# Altium project Quad-Stage-Prototype.PrjPcb
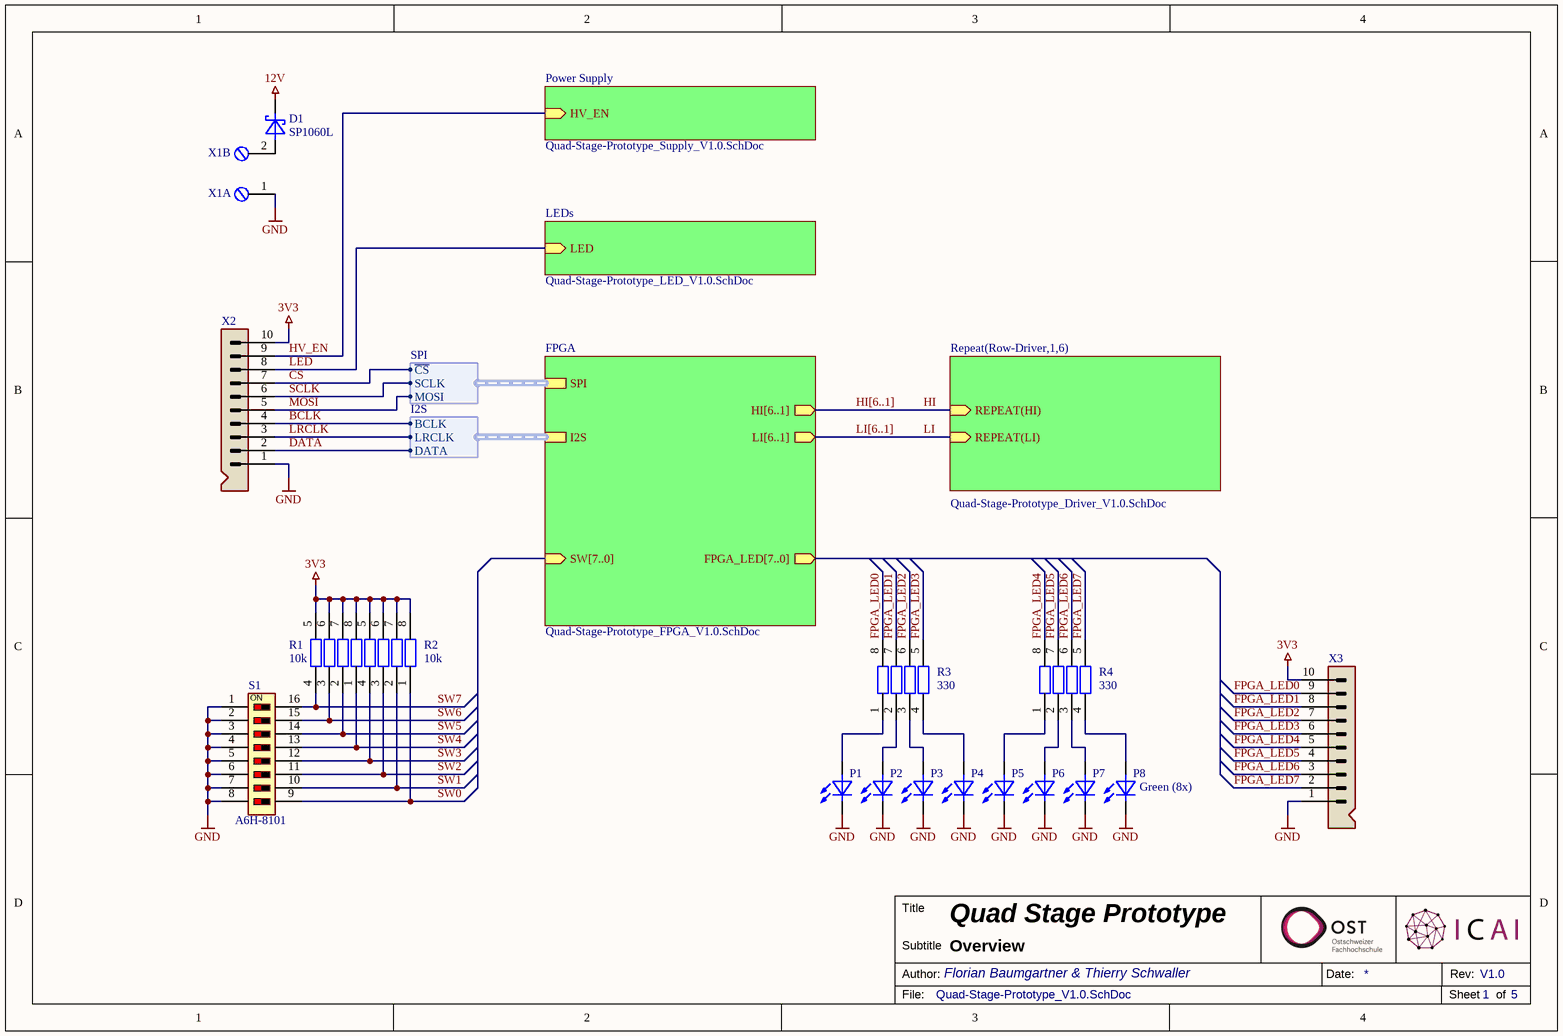
[diagram p0: Quad-Stage-Prototype_V1.0.SchDoc]
5 sheets, 273 parts. Net scope: hierarchical (ports join the sheet entries above them; power ports are global).
Board file: Quad-Stage-Prototype_V1.0.PcbDoc
Sheets:
  Quad-Stage-Prototype_V1.0.SchDoc
    Row-Driver1 = Quad-Stage-Prototype_Driver_V1.0.SchDoc
    Row-Driver2 = Quad-Stage-Prototype_Driver_V1.0.SchDoc
    Row-Driver3 = Quad-Stage-Prototype_Driver_V1.0.SchDoc
    Row-Driver4 = Quad-Stage-Prototype_Driver_V1.0.SchDoc
    Row-Driver5 = Quad-Stage-Prototype_Driver_V1.0.SchDoc
    Row-Driver6 = Quad-Stage-Prototype_Driver_V1.0.SchDoc
    Power Supply = Quad-Stage-Prototype_Supply_V1.0.SchDoc
    FPGA = Quad-Stage-Prototype_FPGA_V1.0.SchDoc
    LEDs = Quad-Stage-Prototype_LED_V1.0.SchDoc

## Sheet Quad-Stage-Prototype_V1.0.SchDoc: Quad Stage Prototype
size A4; PageSetup: Record=PageOptions|CenterHorizontal=True|CenterVertical=True|PrintScale=0.97|XCorrection=1.00|YCorrection=1.00|PrintKind=0|BorderSize=5000000|LeftOffset=0|BottomOffset=0|Orientation=2|PaperLength=1000|PaperWidth=1000|Scale=100|PaperSource=7|PrintQuality=-3|MediaType=1|DitherType=10|PrintScaleMode=1|PaperKind=A4|PaperIndex=9; Organization: Ostschweizer Fachhochschule; Address2: Florian Baumgartner & Thierry Schwaller; Address3: florian.baumgartner@ost.ch; DocumentNumber: 1; Revision: V1.0; SheetNumber: 1; SheetTotal: 5; Author: Florian Baumgartner & Thierry Schwaller; Subtitle: Overview

### Parts
D1  SP1060L  [SMD Diode TO-277]
P1  Green  [SMD LED 0603]  (value not drawn)
P2  Green  [SMD LED 0603]  (value not drawn)
P3  Green  [SMD LED 0603]  (value not drawn)
P4  Green  [SMD LED 0603]  (value not drawn)
P5  Green  [SMD LED 0603]  (value not drawn)
P6  Green  [SMD LED 0603]  (value not drawn)
P7  Green  [SMD LED 0603]  (value not drawn)
P8  Green  [SMD LED 0603]  (value not drawn)
R1  10k  [SMD Widerstand Array 4-Fach 0603]
R2  10k  [SMD Widerstand Array 4-Fach 0603]
R3  330  [SMD Widerstand Array 4-Fach 0603]
R4  330  [SMD Widerstand Array 4-Fach 0603]
S1  A6H-8101  [SMD DIP-Switch 8-Pos]
X1  X-Klemme (2-Pol)  [THT Schraubklemme 2-Pol (WJ500V-5.08-2P)]  (value not drawn)  (parts A,B of 2)
X2  Stiftleiste (10-Fach)  [THT Pin-Header 10x1 (90°)]  (value not drawn)
X3  Stiftleiste (10-Fach)  [THT Pin-Header 10x1 (90°)]  (value not drawn)

### Sub-sheets
FPGA = Quad-Stage-Prototype_FPGA_V1.0.SchDoc: LI[6..1] (out), HI[6..1] (out), I2S (harness I2S), SPI (harness SPI), FPGA_LED[7..0] (out), SW[7..0] (in)
LEDs = Quad-Stage-Prototype_LED_V1.0.SchDoc: LED (in)
Power Supply = Quad-Stage-Prototype_Supply_V1.0.SchDoc: HV_EN (in)
Repeat(Row-Driver,1,6) = Quad-Stage-Prototype_Driver_V1.0.SchDoc: REPEAT(HI) (in), REPEAT(LI) (in)

### Harnesses
SPI: SCLK, MOSI, ~{CS}
I2S: BCLK, LRCLK, DATA

### Nets
3V3: R1.5 R1.6 R1.7 R1.8 R2.5 R2.6 R2.7 R2.8 X2.10 X3.10
12V: D1.K
GND: P1.K P2.K P3.K P4.K P5.K P6.K P7.K P8.K S1.1 S1.2 S1.3 S1.4 S1.5 S1.6 S1.7 S1.8 X1.1 X2.1 X3.1
BCLK: X2.4 ; sheet FPGA/I2S.BCLK
~{CS}: X2.7 ; sheet FPGA/SPI.~{CS}
DATA: X2.2 ; sheet FPGA/I2S.DATA
FPGA_LED0: R3.8 X3.9
FPGA_LED1: R3.7 X3.8
FPGA_LED2: R3.6 X3.7
FPGA_LED3: R3.5 X3.6
FPGA_LED4: R4.8 X3.5
FPGA_LED5: R4.7 X3.4
FPGA_LED6: R4.6 X3.3
FPGA_LED7: R4.5 X3.2
HI: sheet Repeat(Row-Driver,1,6)/REPEAT(HI)
HV_EN: X2.9 ; sheet Power Supply/HV_EN
LED: X2.8 ; sheet LEDs/LED
LI: sheet Repeat(Row-Driver,1,6)/REPEAT(LI)
LRCLK: X2.3 ; sheet FPGA/I2S.LRCLK  [project net FPGA_C9]
MOSI: X2.5 ; sheet FPGA/SPI.MOSI  [project net FPGA_C5]
SCLK: X2.6 ; sheet FPGA/SPI.SCLK  [project net FPGA_C3]
SW0: R2.1 S1.9
SW1: R2.2 S1.10
SW2: R2.3 S1.11
SW3: R2.4 S1.12
SW4: R1.1 S1.13
SW5: R1.2 S1.14
SW6: R1.3 S1.15
SW7: R1.4 S1.16
NetD1_A: D1.A X1.2
NetP1_A: P1.A R3.1
NetP2_A: P2.A R3.2
NetP3_A: P3.A R3.3
NetP4_A: P4.A R3.4
NetP5_A: P5.A R4.1
NetP6_A: P6.A R4.2
NetP7_A: P7.A R4.3
NetP8_A: P8.A R4.4

### Buses and harness runs
bus HI[6..1] = sheet FPGA/HI[6..1]
bus LI[6..1] = sheet FPGA/LI[6..1]

### Notes on the sheet
- (near P8) Green (8x)
- Title
- Author:
- Subtitle
- Date:
- Rev:
- File:
- Sheet
- of
- (in symbol S-A6H-8101) ON

### Library data of the parts
D1 = R-DIODE:SCHKY: S-DIODE; Component Description: Low Voltage Schottky-Diode; JLC-Parts: C2693399; ComponentLink1Description: Datasheet; ComponentLink1URL: https://datasheet.lcsc.com/lcsc/2103051837_Changjiang-Electronics-Tech--CJ-SP1060L_C2693399.pdf; Component Value: SP1060L; Unit Price: 0.32
P1-P8 = LED Green 0603: General Purpose LED; Component Value: Green (5mA, 2.4V); Digikey: 350-2035-1-ND; Farnell: 1465991; Mouser: 645-598-8070-107F; Unit Price: 0.34; ComponentLink1Description: Datasheet; ComponentLink1URL: https://datasheet.lcsc.com/szlcsc/Everlight-Elec-19-217-GHC-YR1S2-3T_C72043.pdf; JLC-Parts: C72043; Component Description: General Purpose LED
R1 R2 = R-Array Single Quad E24 - 10k: Isolated Resistor Array; Component Value: 10k (4x, 50V, 62.5mW, 5%); ComponentLink1Description: Datasheet; ComponentLink1URL: https://datasheet.lcsc.com/lcsc/1810191515_UNI-ROYAL-Uniroyal-Elec-4D03WGJ0103T5E_C29718.pdf; Digikey: Y4103CT-ND; Farnell: 2060167; JLC-Parts: C29718; Mouser: 667-EXB-V8V103JV; Unit Price: 0.01; Component Description: Isolated Resistor Array
R3 R4 = R-Array Single Quad E24 - 330: Isolated Resistor Array; Component Value: 330 (4x, 50V, 62.5mW, 5%); ComponentLink1Description: Datasheet; ComponentLink1URL: https://datasheet.lcsc.com/lcsc/1810170717_UNI-ROYAL-Uniroyal-Elec-4D03WGJ0331T5E_C12018.pdf; Digikey: Y4331CT-ND; Farnell: 2060160; JLC-Parts: C12018; Mouser: 667-EXB-V8V331JV; Unit Price: 0.01; Component Description: Isolated Resistor Array
S1 = S-A6H-8101: DIP-Switch 8 Positions; Digikey: SW1118-ND; Farnell: 8774277; Mouser: 653-A6H-8101; JLC-Parts: C89711; Component Description: DIP-Switch 8 Positions; Component Value: A6H-8101; Unit Price: 2.92
X1 = X-Klemme (2-Pol): Component Description: Screw Terminal; Component Value: WJ500V-5.08-2P (2-Pol, 250V, 8A, 5.08mm); ComponentLink1Description: Datasheet; ComponentLink1URL: https://datasheet.lcsc.com/lcsc/1912251636_Ningbo-Kangnex-Elec-WJ500V-5-08-2P_C8465.pdf; JLC-Parts: C8465; Unit Price: 0.08
X2 X3 = X-Stiftleiste (10-Fach): Component Description: Pin Header; Component Value: 10-Pol; Digikey: 952-2250-ND; Farnell: 3756366; Mouser: 855-M20-9961045; Unit Price: 0.55

## Sheet Quad-Stage-Prototype_Driver_V1.0.SchDoc: Quad Stage Prototype
size A4; PageSetup: Record=PageOptions|CenterHorizontal=True|CenterVertical=True|PrintScale=0.97|XCorrection=1.00|YCorrection=1.00|PrintKind=0|BorderSize=5000000|LeftOffset=0|BottomOffset=0|Orientation=2|PaperLength=1000|PaperWidth=1000|Scale=100|PaperSource=7|PrintQuality=-3|MediaType=1|DitherType=10|PrintScaleMode=1|PaperKind=A4|PaperIndex=9; Organization: Ostschweizer Fachhochschule; Address2: Florian Baumgartner & Thierry Schwaller; Address3: florian.baumgartner@ost.ch; DocumentNumber: 4; Revision: V1.0; SheetNumber: 4; SheetTotal: 5; Author: Florian Baumgartner & Thierry Schwaller; Subtitle: H-Bridge Driver
Used 6 times, as channels Row-Driver1, Row-Driver2, Row-Driver3, Row-Driver4, Row-Driver5, Row-Driver6. Parts and nets are listed once, with the designators drawn on the sheet.
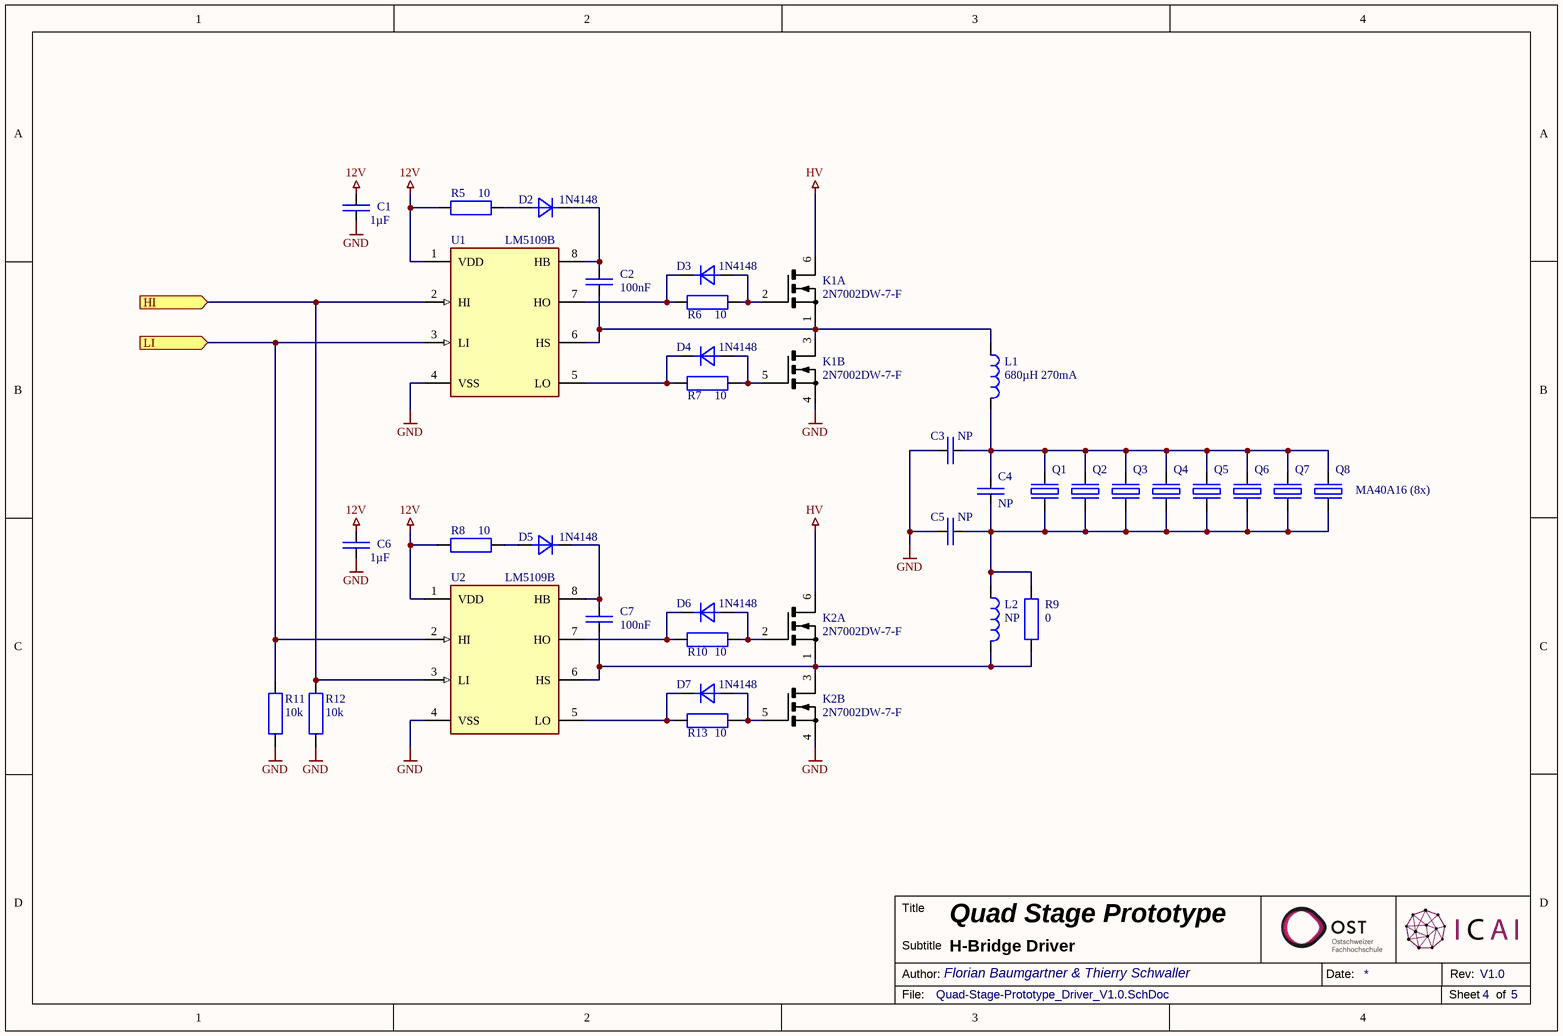
[diagram p1: Quad-Stage-Prototype_Driver_V1.0.SchDoc]

### Parts
C1  1µF  [SMD Keramikkondensator 0603]
C2  100nF  [SMD Keramikkondensator 0603]
C3  NP  [SMD Keramikkondensator 0603]
C4  NP  [SMD Keramikkondensator 0603]
C5  NP  [SMD Keramikkondensator 0603]
C6  1µF  [SMD Keramikkondensator 0603]
C7  100nF  [SMD Keramikkondensator 0603]
D2  1N4148  [SMD Diode SOD-123]
D3  1N4148  [SMD Diode SOD-123]
D4  1N4148  [SMD Diode SOD-123]
D5  1N4148  [SMD Diode SOD-123]
D6  1N4148  [SMD Diode SOD-123]
D7  1N4148  [SMD Diode SOD-123]
K1  2N7002DW-7-F  [SMD IC SOT-363 (SC-70-6)]  (parts A,B of 2)
K2  2N7002DW-7-F  [SMD IC SOT-363 (SC-70-6)]  (parts A,B of 2)
L1  680µH 270mA  [SMD Inductor 7x7x4.5]
L2  NP  [SMD Inductor 7x7x4.5 NP]
Q1  MA40A16  [THT Transducer (MA40A16)]  (value not drawn)
Q2  MA40A16  [THT Transducer (MA40A16)]  (value not drawn)
Q3  MA40A16  [THT Transducer (MA40A16)]  (value not drawn)
Q4  MA40A16  [THT Transducer (MA40A16)]  (value not drawn)
Q5  MA40A16  [THT Transducer (MA40A16)]  (value not drawn)
Q6  MA40A16  [THT Transducer (MA40A16)]  (value not drawn)
Q7  MA40A16  [THT Transducer (MA40A16)]  (value not drawn)
Q8  MA40A16  [THT Transducer (MA40A16)]  (value not drawn)
R5  10  [SMD Widerstand 0603]
R6  10  [SMD Widerstand 0603]
R7  10  [SMD Widerstand 0603]
R8  10  [SMD Widerstand 0603]
R9  0  [SMD Widerstand 0603]
R10  10  [SMD Widerstand 0603]
R11  10k  [SMD Widerstand 0603]
R12  10k  [SMD Widerstand 0603]
R13  10  [SMD Widerstand 0603]
U1  LM5109B  [SMD IC SOIC-8]
U2  LM5109B  [SMD IC SOIC-8]

### Ports
HI (in), LI (in)

### Nets
12V: C1.2 C6.2 R5.2 R8.2 U1.1(VDD) U2.1(VDD)
GND: C1.1 C3.2 C5.2 C6.1 K1.4(S2) K2.4(S2) R11.1 R12.1 U1.4(VSS) U2.4(VSS)
HV: K1.6(D1) K2.6(D1)
HI: R12.2 U1.2(HI) U2.3(LI) ; port HI
LI: R11.2 U1.3(LI) U2.2(HI) ; port LI
NetC2_1: C2.1 K1.1(S1) K1.3(D2) L1.1 U1.6(HS)
NetC2_2: C2.2 D2.K U1.8(HB)
NetC3_1: C3.1 C4.2 L1.2 Q1.2 Q2.2 Q3.2 Q4.2 Q5.2 Q6.2 Q7.2 Q8.2
NetC4_1: C4.1 C5.1 L2.2 Q1.1 Q2.1 Q3.1 Q4.1 Q5.1 Q6.1 Q7.1 Q8.1 R9.2
NetC7_1: C7.1 K2.1(S1) K2.3(D2) L2.1 R9.1 U2.6(HS)
NetC7_2: C7.2 D5.K U2.8(HB)
NetD2_A: D2.A R5.1
NetD3_A: D3.A K1.2(G1) R6.1
NetD3_K: D3.K R6.2 U1.7(HO)
NetD4_A: D4.A K1.5(G2) R7.1
NetD4_K: D4.K R7.2 U1.5(LO)
NetD5_A: D5.A R8.1
NetD6_A: D6.A K2.2(G1) R10.1
NetD6_K: D6.K R10.2 U2.7(HO)
NetD7_A: D7.A K2.5(G2) R13.1
NetD7_K: D7.K R13.2 U2.5(LO)

### Channels
Row-Driver1: designators end in _1; ports HI=FPGA_B48 LI=FPGA_B49
Row-Driver2: designators end in _2; ports HI=FPGA_B45 LI=FPGA_B46
Row-Driver3: designators end in _3; ports HI=FPGA_B42 LI=FPGA_B43
Row-Driver4: designators end in _4; ports HI=FPGA_B39 LI=FPGA_B40
Row-Driver5: designators end in _5; ports HI=FPGA_B36 LI=FPGA_B37
Row-Driver6: designators end in _6; ports HI=FPGA_B33 LI=FPGA_B34

### Notes on the sheet
- (near Q8) MA40A16 (8x)
- Title
- Author:
- Subtitle
- Date:
- Rev:
- File:
- Sheet
- of

### Library data of the parts
C1 C6 = C-CAPACITOR: CAP-MK; Component Description: Multilayer Ceramic Capacitors; Component Value: 1µF 50V; Digikey: 1276-1860-1-ND; Farnell: 3013383; Mouser: 187-CL10A105KB8NNNC; JLC-Parts: C15849; Unit Price: 0.01
C2 C7 = C-CAPACITOR: CAP-MK; Component Description: Multilayer Ceramic Capacitors; Component Value: 100nF 50V; Digikey: 445-5666-1-ND; Farnell: 2522432; Mouser: 77-VJ0603V104ZXAPBC; JLC-Parts: C14663; Unit Price: 0.01
C3-C5 = C-CAPACITOR: CAP-MK; Component Description: Multilayer Ceramic Capacitors; Component Value: NP
D2-D7 = R-DIODE: DIODE (alt V); Component Description: Fast Switching Diode; Component Value: 1N4148WTR; Digikey: 1655-1360-1-ND; Farnell: 2306363; Mouser: 750-1N4148W-HF; ComponentLink1Description: Datasheet; ComponentLink1URL: https://datasheet.lcsc.com/lcsc/1811061725_ST-Semtech-1N4148W_C81598.pdf; JLC-Parts: C81598; Unit Price: 0.01
K1 K2 = K-2N7002DW-7-F: Dual N-Channel MOSFET; Digikey: 2N7002DW-FDICT-ND; Mouser: 621-2N7002DW-F; ComponentLink1Description: Datasheet; ComponentLink1URL: https://datasheet.lcsc.com/lcsc/1810111020_Diodes-Incorporated-2N7002DW-7-F_C83571.pdf; JLC-Parts: C83571; Component Description: Dual N-Channel MOSFET; Component Value: 2N7002DW-7-F; Unit Price: 0.35
L1 = L-COIL: Shielded Power Inductor; Component Value: SLF7045T-681MR20-PF (680µH 270mA); ComponentLink1Description: Datasheet; ComponentLink1URL: https://datasheet.lcsc.com/lcsc/1806061130_TDK-SLF7045T-681MR20-PF_C91522.pdf; Digikey: 445-2028-1-ND; Farnell: 2215732; JLC-Parts: C91522; Mouser: 810-SLF7045T-681M; Component Description: Shielded Power Inductor; Unit Price: 0.32
L2 = L-COIL: Shielded Power Inductor; ComponentLink1Description: Datasheet; Component Description: Shielded Power Inductor
Q1-Q8 = Q-Piezo: Ultrasonic Transducer; Component Value: MA40A16 (40kHz, 16mm); ComponentLink1Description: Datasheet; Component Description: Ultrasonic Transducer; Unit Price: 0.40
  Q2-Q8: JLC-Parts: C115962
R5-R8 R10 R13 = R-RESISTOR: RES (E=Heizwiderstand B=Messwandler); Component Description: Thick Film Chip Resistor; Component Value: 10 (75V, 100mW, 1%); Digikey: P10.0HCT-ND; Farnell: 2302958; Mouser: 667-ERJ-3EKF10R0V; JLC-Parts: C22859; Unit Price: 0.01
R9 = R-RESISTOR: RES (E=Heizwiderstand B=Messwandler); Component Description: Thick Film Chip Resistor; Component Value: 0 (75V, 100mW, 1%); Digikey: 311-0.0GRCT-ND; Farnell: 9233130; Mouser: 603-RC0603JR-070RL; JLC-Parts: C21189; Unit Price: 0.01
R11 R12 = R-RESISTOR: RES (E=Heizwiderstand B=Messwandler); Component Description: Thick Film Chip Resistor; Component Value: 10k (75V, 100mW, 1%); Digikey: P10.0KHCT-ND; Farnell: 2303192; Mouser: 667-ERJ-3EKF1002V; JLC-Parts: C25804; Unit Price: 0.01
U1 U2 = U-LM5109B: High Voltage 1A Peak Half Bridge Gate Driver; Component Description: High Voltage Gate Driver; ComponentLink1Description: Datasheet; ComponentLink1URL: https://datasheet.lcsc.com/lcsc/1809172040_Texas-Instruments-LM5109AMAX-NOPB_C129332.pdf; Digikey: LM5109BMA/NOPB-ND; Component Value: LM5109B; Farnell: 3005776; JLC-Parts: C116862; Mouser: 926-LM5109BMAX/NOPB; Unit Price: 1.13

## Sheet Quad-Stage-Prototype_Supply_V1.0.SchDoc: Quad Stage Prototype
size A4; PageSetup: Record=PageOptions|CenterHorizontal=True|CenterVertical=True|PrintScale=0.97|XCorrection=1.00|YCorrection=1.00|PrintKind=0|BorderSize=5000000|LeftOffset=0|BottomOffset=0|Orientation=2|PaperLength=1000|PaperWidth=1000|Scale=100|PaperSource=7|PrintQuality=-3|MediaType=1|DitherType=10|PrintScaleMode=1|PaperKind=A4|PaperIndex=9; Organization: Ostschweizer Fachhochschule; Address2: Florian Baumgartner & Thierry Schwaller; Address3: florian.baumgartner@ost.ch; DocumentNumber: 2; Revision: V1.0; SheetNumber: 2; SheetTotal: 5; Author: Florian Baumgartner & Thierry Schwaller; Subtitle: Power Supply
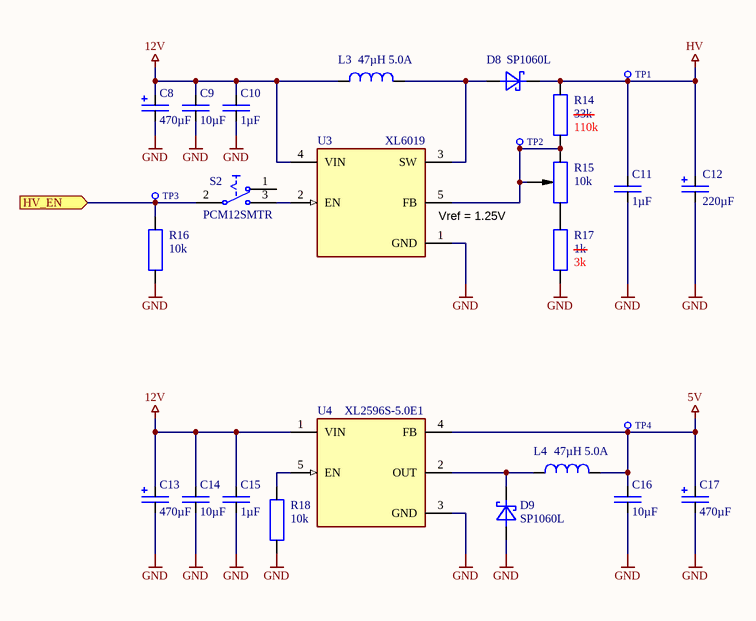
[diagram p2: Quad-Stage-Prototype_Supply_V1.0.SchDoc]

### Parts
C8  470µF  [SMD Elko 10.0x10.0]
C9  10µF  [SMD Keramikkondensator 1206]
C10  1µF  [SMD Keramikkondensator 0603]
C11  1µF  [SMD Keramikkondensator 1206]
C12  220µF  [SMD Elko 12.5x13.5]
C13  470µF  [SMD Elko 10.0x10.0]
C14  10µF  [SMD Keramikkondensator 1206]
C15  1µF  [SMD Keramikkondensator 0603]
C16  10µF  [SMD Keramikkondensator 1206]
C17  470µF  [SMD Elko 10.0x10.0]
D8  SP1060L  [SMD Diode TO-277]
D9  SP1060L  [SMD Diode TO-277]
L3  47µH 5.0A  [SMD Inductor 13.8x12.6x6.5]
L4  47µH 5.0A  [SMD Inductor 13.8x12.6x6.5]
R14  33k  [SMD Widerstand 0603]
R15  10k  [THT Potentiometer (RK09D1130C2P)]
R16  10k  [SMD Widerstand 0603]
R17  1k  [SMD Widerstand 0603]
R18  10k  [SMD Widerstand 0603]
S2  PCM12SMTR  [SMD Switch SPDT (PCM12SMTR)]
TP1  X-TP  [THT Testpunkt Ø1mm]  (value not drawn)  (no BOM)
TP2  X-TP  [THT Testpunkt Ø1mm]  (value not drawn)  (no BOM)
TP3  X-TP  [THT Testpunkt Ø1mm]  (value not drawn)  (no BOM)
TP4  X-TP  [THT Testpunkt Ø1mm]  (value not drawn)  (no BOM)
U3  XL6019  [SMD IC TO-263-5]
U4  XL2596S-5.0E1  [SMD IC TO-263-5]

### Ports
HV_EN (in)

### Nets
5V: C16.2 C17.P(+) L4.1 TP4.1 U4.4(FB)
12V: C8.P(+) C9.2 C10.2 C13.P(+) C14.2 C15.2 L3.1 U3.4(VIN) U4.1(VIN)
GND: C8.M(-) C9.1 C10.1 C11.1 C12.M(-) C13.M(-) C14.1 C15.1 C16.1 C17.M(-) D9.A R16.1 R17.1 R18.1 U3.1(GND) U4.3(GND)
HV: C11.2 C12.P(+) D8.K R14.2 TP1.1
HV_EN: R16.2 S2.2(COMMON1) TP3.1 ; port HV_EN
NetD8_A: D8.A L3.2 U3.3(SW)
NetD9_K: D9.K L4.2 U4.2(OUT)
NetR14_1: R14.1 R15.CW R15.M TP2.1 U3.5(FB)
NetR15_CCW: R15.CCW R17.2
NetR18_2: R18.2 U4.5(EN)
NetS2_3: S2.3(NO1) U3.2(EN)

Not connected (* = marked no-connect by the designer): S2 1(NC1)

### Notes on the sheet
- (near R14) 110k
- (near U3) Vref = 1.25V
- (near R17) 3k
- Title
- Author:
- Subtitle
- Date:
- Rev:
- File:
- Sheet
- of

### Library data of the parts
C8 C13 C17 = C-ELCAP: CAP-Elko; Component Description: Electrolytic Capacitor; Component Value: 470µF 25V; Mouser: 140-VEJ471M1ETR1010; JLC-Parts: C176672; Unit Price: 0.17
C9 C14 C16 = C-CAPACITOR: CAP-MK; Component Description: Multilayer Ceramic Capacitors; Component Value: 10µF 50V; Digikey: 445-7886-1-ND; Farnell: 2211092; Mouser: 810-CGA5L3X5R1H106K; JLC-Parts: C13585; Unit Price: 0.27
C10 C15 = C-CAPACITOR: as C1 on sheet Quad-Stage-Prototype_Driver_V1.0; Digikey: 1276-1860-1-ND; Farnell: 3013383; Mouser: 187-CL10A105KB8NNNC; JLC-Parts: C15849; Unit Price: 0.01
C11 = C-CAPACITOR: CAP-MK; Component Description: Multilayer Ceramic Capacitors; Component Value: 1µF 100V; Digikey: 720-VJ1206Y104MXBATCT-ND; Farnell: 1657939; Mouser: 77-VJ1206Y104MXBAT; JLC-Parts: C91151; Unit Price: 0.01
C12 = C-ELCAP: CAP-Elko; Component Description: Electrolytic Capacitor; Component Value: 220µF 63V; JLC-Parts: C249502; Unit Price: 0.42
D8 D9 = R-DIODE:SCHKY: as D1 on sheet Quad-Stage-Prototype_V1.0; JLC-Parts: C2693399; ComponentLink1Description: Datasheet; ComponentLink1URL: https://datasheet.lcsc.com/lcsc/2103051837_Changjiang-Electronics-Tech--CJ-SP1060L_C2693399.pdf; Component Value: SP1060L; Unit Price: 0.32
L3 L4 = L-COIL: Shielded Power Inductor; ComponentLink1Description: Datasheet; ComponentLink1URL: https://datasheet.lcsc.com/lcsc/2003172239_YJYCOIN-YSPI1365-470M_C497913.pdf; Digikey: 118-SRP1265WA-470MCT-ND; Farnell: 3929029; JLC-Parts: C497913; Mouser: 652-SRP1265WA-470M; Component Description: Shielded Power Inductor; Component Value: 47µH 5.0A; Unit Price: 0.68
R14 = R-RESISTOR: RES (E=Heizwiderstand B=Messwandler); Component Description: Thick Film Chip Resistor; Component Value: 33k (75V, 100mW, 1%); Digikey: P33.0KHCT-ND; Farnell: 2303204; Mouser: 667-ERJ-3EKF3302V; JLC-Parts: C4216; Unit Price: 0.01
R15 = R-RES:VAR: RES-VAR; Component Description: Potentiometer; Component Value: RK09D1130C2P (10k); ComponentLink1Description: Datasheet; ComponentLink1URL: https://tech.alpsalpine.com/prod/e/html/potentiometer/rotarypotentiometers/rk09k/rk09d1130c2p.html; JLC-Parts: C361173; Mouser: 688-RK09D1130C2P; Unit Price: 0.90
R16 R18 = R-RESISTOR: as R11 on sheet Quad-Stage-Prototype_Driver_V1.0; Digikey: P10.0KHCT-ND; Farnell: 2303192; Mouser: 667-ERJ-3EKF1002V; JLC-Parts: C25804; Unit Price: 0.01
R17 = R-RESISTOR: RES (E=Heizwiderstand B=Messwandler); Component Description: Thick Film Chip Resistor; Component Value: 1k (75V, 100mW, 1%); Digikey: P1.00KHCT-ND; Farnell: 2397690; Mouser: 667-ERJ-3EKF1001V; JLC-Parts: C21190; Unit Price: 0.01
S2 = S-PCM12SMTR: Miniature Slide Switch; aliExpress: 33002042977; Component Value: PCM12SMTR (SPDT); Digikey: 401-2016-1-ND; Mouser: 611-PCM12SMTR; Farnell: 9575146; JLC-Parts: C221841; Component Description: Miniature Slide Switch; Unit Price: 0.77
TP1-TP4 = X-TP: Testpunkt; Component Description: Testpoint; Component Value: Ø 0.8mm; Unit Price: 0.00
U3 = U-XL6019: High Power Switching Boost Converter; ComponentLink1Description: Datasheet; ComponentLink1URL: http://www.xlsemi.com/datasheet/XL6019%20datasheet-English.pdf; Component Value: XL6019; JLC-Parts: C73018; Unit Price: 1.00; Component Description: High Power Switching Boost Converter
U4 = U-XL2596S-5.0E1: High Power Switching Buck Converter; ComponentLink1Description: Datasheet; ComponentLink1URL: https://datasheet.lcsc.com/lcsc/1811021340_XLSEMI-XL2596S-5-0E1_C74190.pdf; Component Value: XL2596S-5.0E1; JLC-Parts: C74190; Unit Price: 0.58; Component Description: High Power Switching Buck Converter

## Sheet Quad-Stage-Prototype_FPGA_V1.0.SchDoc: Quad Stage Prototype
size A4; PageSetup: Record=PageOptions|CenterHorizontal=True|CenterVertical=True|PrintScale=0.97|XCorrection=1.00|YCorrection=1.00|PrintKind=0|BorderSize=5000000|LeftOffset=0|BottomOffset=0|Orientation=2|PaperLength=1000|PaperWidth=1000|Scale=100|PaperSource=7|PrintQuality=-3|MediaType=1|DitherType=10|PrintScaleMode=1|PaperKind=A4|PaperIndex=9; Organization: Ostschweizer Fachhochschule; Address2: Florian Baumgartner & Thierry Schwaller; Address3: florian.baumgartner@ost.ch; DocumentNumber: 3; Revision: V1.0; SheetNumber: 3; SheetTotal: 5; Author: Florian Baumgartner & Thierry Schwaller; Subtitle: FPGA
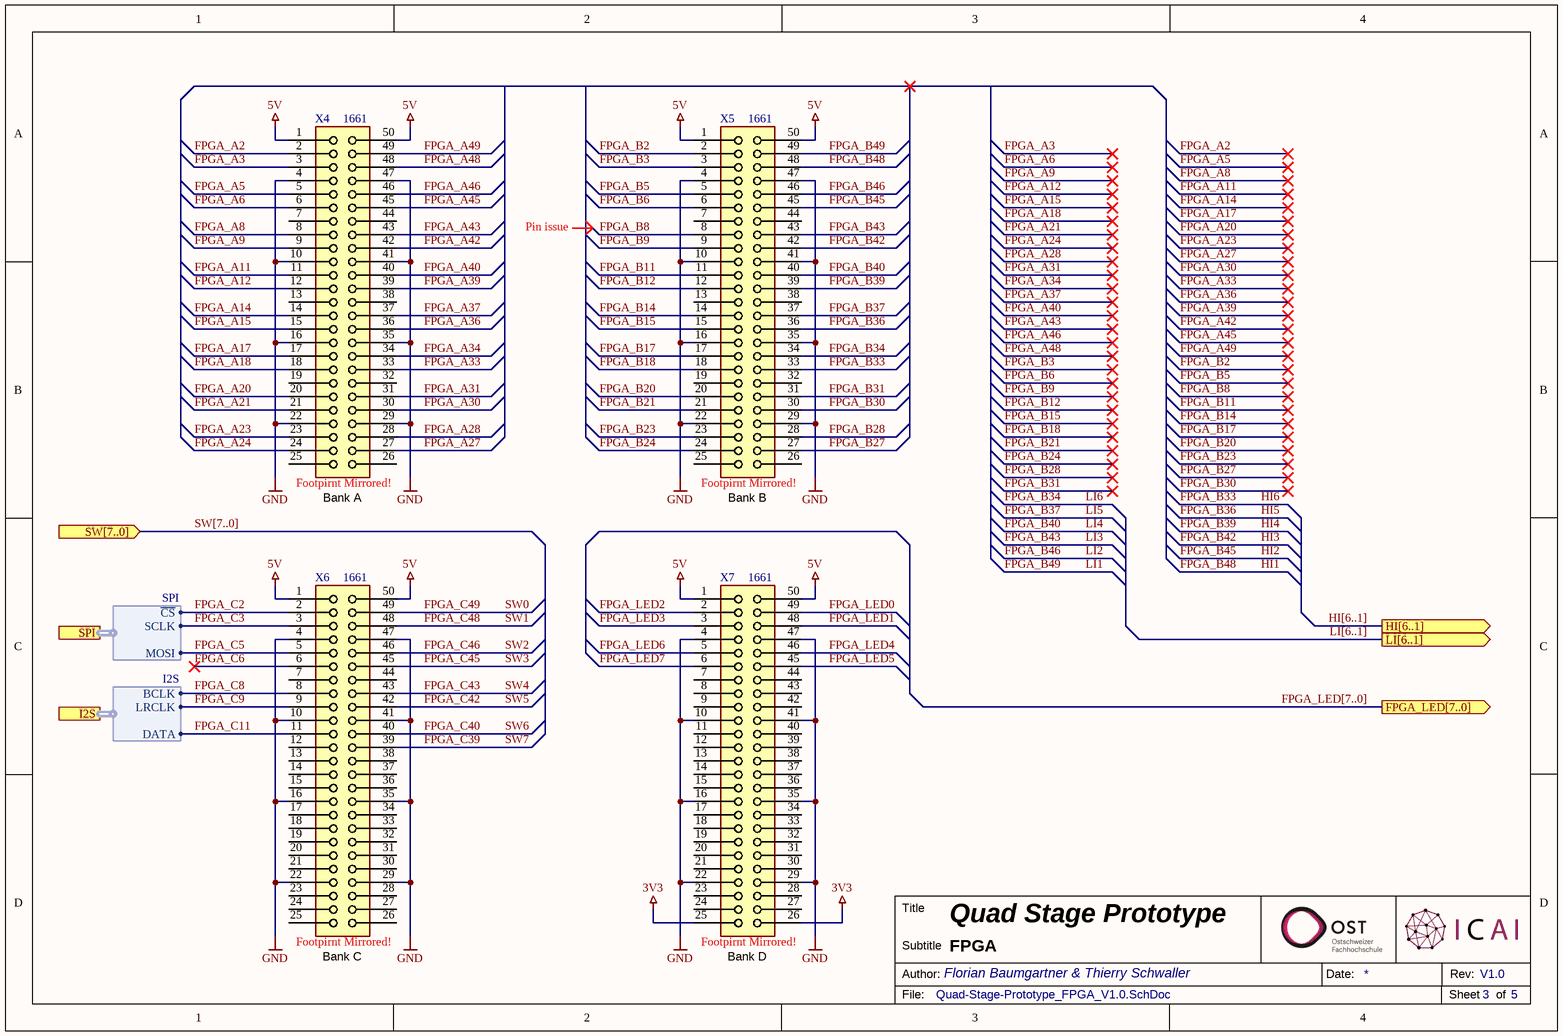
[diagram p3: Quad-Stage-Prototype_FPGA_V1.0.SchDoc]

### Parts
X4  1661  [SMD Connector (1661)]
X5  1661  [SMD Connector (1661)]
X6  1661  [SMD Connector (1661)]
X7  1661  [SMD Connector (1661)]

### Ports
FPGA_LED[7..0] (out), HI[6..1] (out), I2S (harness I2S), LI[6..1] (out), SPI (harness SPI), SW[7..0] (in)

### Harnesses
SPI: SCLK, MOSI, ~{CS}
I2S: BCLK, LRCLK, DATA

### Nets
3V3: X7.25 X7.26
5V: X4.1 X4.50 X5.1 X5.50 X6.1 X6.50 X7.1 X7.50
GND: X4.4 X4.10 X4.16 X4.22 X4.29 X4.35 X4.41 X4.47 X5.4 X5.10 X5.16 X5.22 X5.29 X5.35 X5.41 X5.47 X6.4 X6.10 X6.16 X6.22 X6.29 X6.35 X6.41 X6.47 X7.4 X7.10 X7.16 X7.22 X7.29 X7.35 X7.41 X7.47
FPGA_A2: X4.2
FPGA_A3: X4.3
FPGA_A5: X4.5
FPGA_A6: X4.6
FPGA_A8: X4.8
FPGA_A9: X4.9
FPGA_A11: X4.11
FPGA_A12: X4.12
FPGA_A14: X4.14
FPGA_A15: X4.15
FPGA_A17: X4.17
FPGA_A18: X4.18
FPGA_A20: X4.20
FPGA_A21: X4.21
FPGA_A23: X4.23
FPGA_A24: X4.24
FPGA_A27: X4.27
FPGA_A28: X4.28
FPGA_A30: X4.30
FPGA_A31: X4.31
FPGA_A33: X4.33
FPGA_A34: X4.34
FPGA_A36: X4.36
FPGA_A37: X4.37
FPGA_A39: X4.39
FPGA_A40: X4.40
FPGA_A42: X4.42
FPGA_A43: X4.43
FPGA_A45: X4.45
FPGA_A46: X4.46
FPGA_A48: X4.48
FPGA_A49: X4.49
FPGA_B2: X5.2
FPGA_B3: X5.3
FPGA_B5: X5.5
FPGA_B6: X5.6
FPGA_B8: X5.8
FPGA_B9: X5.9
FPGA_B11: X5.11
FPGA_B12: X5.12
FPGA_B14: X5.14
FPGA_B15: X5.15
FPGA_B17: X5.17
FPGA_B18: X5.18
FPGA_B20: X5.20
FPGA_B21: X5.21
FPGA_B23: X5.23
FPGA_B24: X5.24
FPGA_B27: X5.27
FPGA_B28: X5.28
FPGA_B30: X5.30
FPGA_B31: X5.31
FPGA_B33: X5.33  [also labelled HI6]
FPGA_B34: X5.34  [also labelled LI6]
FPGA_B36: X5.36  [also labelled HI5]
FPGA_B37: X5.37  [also labelled LI5]
FPGA_B39: X5.39  [also labelled HI4]
FPGA_B40: X5.40  [also labelled LI4]
FPGA_B42: X5.42  [also labelled HI3]
FPGA_B43: X5.43  [also labelled LI3]
FPGA_B45: X5.45  [also labelled HI2]
FPGA_B46: X5.46  [also labelled LI2]
FPGA_B48: X5.48  [also labelled HI1]
FPGA_B49: X5.49  [also labelled LI1]
FPGA_C2: X6.2 ; port SPI.~{CS}  [project net ~{CS}]
FPGA_C3: X6.3 ; port SPI.SCLK
FPGA_C5: X6.5 ; port SPI.MOSI
FPGA_C6: X6.6
FPGA_C8: X6.8 ; port I2S.BCLK  [project net BCLK]
FPGA_C9: X6.9 ; port I2S.LRCLK
FPGA_C11: X6.11 ; port I2S.DATA  [project net DATA]
FPGA_C39: X6.39  [also labelled SW7]
FPGA_C40: X6.40  [also labelled SW6]
FPGA_C42: X6.42  [also labelled SW5]
FPGA_C43: X6.43  [also labelled SW4]
FPGA_C45: X6.45  [also labelled SW3]
FPGA_C46: X6.46  [also labelled SW2]
FPGA_C48: X6.48  [also labelled SW1]
FPGA_C49: X6.49  [also labelled SW0]
FPGA_LED0: X7.49
FPGA_LED1: X7.48
FPGA_LED2: X7.2
FPGA_LED3: X7.3
FPGA_LED4: X7.46
FPGA_LED5: X7.45
FPGA_LED6: X7.5
FPGA_LED7: X7.6

Not connected (* = marked no-connect by the designer): X4 7 13 19 25 26 32 38 44; X5 7 13 19 25 26 32 38 44; X6 7 12 13 14 15 17 18 19 20 21 23 24 25 26 27 28 30 31 32 33 34 36 37 38 44; X7 7 8 9 11 12 13 14 15 17 18 19 20 21 23 24 27 28 30 31 32 33 34 36 37 38 39 40 42 43 44

### Buses and harness runs
bus FPGA_LED[7..0] = port FPGA_LED[7..0]
bus HI[6..1] = port HI[6..1]
bus LI[6..1] = port LI[6..1]
bus SW[7..0] = port SW[7..0]

### Notes on the sheet
- Pin issue
- (near X4) Footpirnt Mirrored!
- (near X4) Bank A
- (near X5) Footpirnt Mirrored!
- (near X5) Bank B
- (near X6) Footpirnt Mirrored!
- (near X6) Bank C
- (near X7) Footpirnt Mirrored!
- (near X7) Bank D
- Title
- Author:
- Subtitle
- Date:
- Rev:
- File:
- Sheet
- of

### Library data of the parts
X4-X7 = X-4UCON_1661: Board-to-Board Connector (Receptacle); Component Value: PRT-16890 (1661); Digikey: 1568-PRT-16890-ND; Mouser: 474-PRT-16890; ComponentLink1Description: Datasheet; ComponentLink1URL: http://www.4uconnector.com/online/object/4udrawing/19008.pdf; Component Description: Board-to-Board Connector (Receptacle); Unit Price: 1.60

## Sheet Quad-Stage-Prototype_LED_V1.0.SchDoc: Quad Stage Prototype
size A4; PageSetup: Record=PageOptions|CenterHorizontal=True|CenterVertical=True|PrintScale=0.97|XCorrection=1.00|YCorrection=1.00|PrintKind=0|BorderSize=5000000|LeftOffset=0|BottomOffset=0|Orientation=2|PaperLength=1000|PaperWidth=1000|Scale=100|PaperSource=7|PrintQuality=-3|MediaType=1|DitherType=10|PrintScaleMode=1|PaperKind=A4|PaperIndex=9; Organization: Ostschweizer Fachhochschule; Address2: Florian Baumgartner & Thierry Schwaller; Address3: florian.baumgartner@ost.ch; DocumentNumber: 5; Revision: V1.0; SheetNumber: 5; SheetTotal: 5; Author: Florian Baumgartner & Thierry Schwaller; Subtitle: LEDs
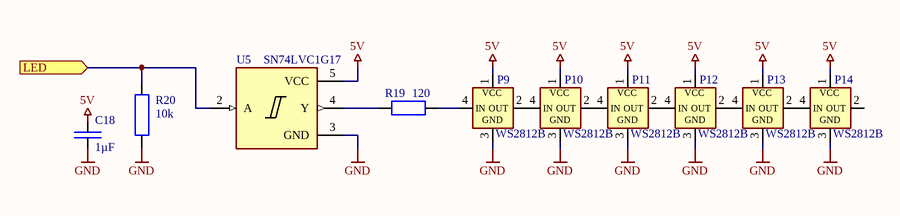
[diagram p4: Quad-Stage-Prototype_LED_V1.0.SchDoc]

### Parts
C18  1µF  [SMD Keramikkondensator 0603]
P9  WS2812B  [SMD LED WS2812B-5050]
P10  WS2812B  [SMD LED WS2812B-5050]
P11  WS2812B  [SMD LED WS2812B-5050]
P12  WS2812B  [SMD LED WS2812B-5050]
P13  WS2812B  [SMD LED WS2812B-5050]
P14  WS2812B  [SMD LED WS2812B-5050]
R19  120  [SMD Widerstand 0603]
R20  10k  [SMD Widerstand 0603]
U5  SN74LVC1G17  [SMD IC SOT-363 (SC-70-5)]

### Ports
LED (in)

### Nets
5V: C18.2 P9.1(VCC) P10.1(VCC) P11.1(VCC) P12.1(VCC) P13.1(VCC) P14.1(VCC) U5.5(VCC)
GND: C18.1 P9.3(GND) P10.3(GND) P11.3(GND) P12.3(GND) P13.3(GND) P14.3(GND) R20.1 U5.3(GND)
LED: R20.2 U5.2(A) ; port LED
NetP9_2: P9.2(OUT) P10.4(IN)
NetP9_4: P9.4(IN) R19.1
NetP10_2: P10.2(OUT) P11.4(IN)
NetP11_2: P11.2(OUT) P12.4(IN)
NetP12_2: P12.2(OUT) P13.4(IN)
NetP13_2: P13.2(OUT) P14.4(IN)
NetR19_2: R19.2 U5.4(Y)

Not connected (* = marked no-connect by the designer): P14 2(OUT); U5 1(NC)

### Notes on the sheet
- Title
- Author:
- Subtitle
- Date:
- Rev:
- File:
- Sheet
- of

### Library data of the parts
C18 = C-CAPACITOR: as C1 on sheet Quad-Stage-Prototype_Driver_V1.0; Digikey: 1276-1860-1-ND; Farnell: 3013383; Mouser: 187-CL10A105KB8NNNC; JLC-Parts: C15849; Unit Price: 0.01
P9-P14 = P-WS2812B: Smart RGB-LED; aliExpress: 32550663121; Digikey: 1568-COM-16346-ND; Mouser: 474-COM-16346; JLC-Parts: C2843785; ComponentLink1Description: Datasheet; ComponentLink1URL: http://cdn.sparkfun.com/datasheets/BreakoutBoards/WS2812B.pdf; Component Description: Smart RGB-LED; Component Value: WS2812B; Unit Price: 0.10
R19 = E24 - 120: SMD Chip Resistor E24; Component Value: 120 (75V, 100mW, 1%); ComponentLink1Description: Datasheet; ComponentLink1URL: https://datasheet.lcsc.com/lcsc/1810200710_UNI-ROYAL-Uniroyal-Elec-0603WAF4701T5E_C23162.pdf; Digikey: P120HCT-ND; Farnell: 2303067; JLC-Parts: C22787; Mouser: 667-ERJ-3EKF1200V; Unit Price: 0.01; Component Description: Chip Resistor
R20 = R-RESISTOR: as R11 on sheet Quad-Stage-Prototype_Driver_V1.0; Digikey: P10.0KHCT-ND; Farnell: 2303192; Mouser: 667-ERJ-3EKF1002V; JLC-Parts: C25804; Unit Price: 0.01
U5 = U-SN74LVC1G17-Q1: Single Schmitt-Trigger Buffer; Digikey: 296-23709-1-ND; Farnell: 2499832; Mouser: 595-74LVC1G17QDCKRQ1; Component Description: Single Schmitt-Trigger Buffer; ComponentLink1Description: Datasheet; ComponentLink1URL: https://datasheet.lcsc.com/lcsc/1809192011_Texas-Instruments-SN74LVC1G17DCKR_C10425.pdf; Component Value: SN74LVC1G17-Q1; JLC-Parts: C10425; Unit Price: 0.36

## Nets that join several sheets
3V3: Quad-Stage-Prototype_V1.0 (10 pins), Quad-Stage-Prototype_FPGA_V1.0 (X7.25 X7.26)
5V: Quad-Stage-Prototype_Supply_V1.0 (5 pins), Quad-Stage-Prototype_FPGA_V1.0 (8 pins), Quad-Stage-Prototype_LED_V1.0 (8 pins)
12V: Quad-Stage-Prototype_V1.0 (D1.K), Row-Driver1 (6 pins), Row-Driver2 (6 pins), Row-Driver3 (6 pins), Row-Driver4 (6 pins), Row-Driver5 (6 pins), Row-Driver6 (6 pins), Quad-Stage-Prototype_Supply_V1.0 (9 pins)
GND: Quad-Stage-Prototype_V1.0 (19 pins), Row-Driver1 (10 pins), Row-Driver2 (10 pins), Row-Driver3 (10 pins), Row-Driver4 (10 pins), Row-Driver5 (10 pins), Row-Driver6 (10 pins), Quad-Stage-Prototype_Supply_V1.0 (16 pins), Quad-Stage-Prototype_FPGA_V1.0 (32 pins), Quad-Stage-Prototype_LED_V1.0 (9 pins)
HV: Row-Driver1 (K1_1.6 K2_1.6), Row-Driver2 (K1_2.6 K2_2.6), Row-Driver3 (K1_3.6 K2_3.6), Row-Driver4 (K1_4.6 K2_4.6), Row-Driver5 (K1_5.6 K2_5.6), Row-Driver6 (K1_6.6 K2_6.6), Quad-Stage-Prototype_Supply_V1.0 (5 pins)
BCLK: Quad-Stage-Prototype_V1.0 (X2.4), Quad-Stage-Prototype_FPGA_V1.0 (X6.8)
~{CS}: Quad-Stage-Prototype_V1.0 (X2.7), Quad-Stage-Prototype_FPGA_V1.0 (X6.2)
DATA: Quad-Stage-Prototype_V1.0 (X2.2), Quad-Stage-Prototype_FPGA_V1.0 (X6.11)
FPGA_B33: Row-Driver6 (R12_6.2 U1_6.2 U2_6.3), Quad-Stage-Prototype_FPGA_V1.0 (X5.33)
FPGA_B34: Row-Driver6 (R11_6.2 U1_6.3 U2_6.2), Quad-Stage-Prototype_FPGA_V1.0 (X5.34)
FPGA_B36: Row-Driver5 (R12_5.2 U1_5.2 U2_5.3), Quad-Stage-Prototype_FPGA_V1.0 (X5.36)
FPGA_B37: Row-Driver5 (R11_5.2 U1_5.3 U2_5.2), Quad-Stage-Prototype_FPGA_V1.0 (X5.37)
FPGA_B39: Row-Driver4 (R12_4.2 U1_4.2 U2_4.3), Quad-Stage-Prototype_FPGA_V1.0 (X5.39)
FPGA_B40: Row-Driver4 (R11_4.2 U1_4.3 U2_4.2), Quad-Stage-Prototype_FPGA_V1.0 (X5.40)
FPGA_B42: Row-Driver3 (R12_3.2 U1_3.2 U2_3.3), Quad-Stage-Prototype_FPGA_V1.0 (X5.42)
FPGA_B43: Row-Driver3 (R11_3.2 U1_3.3 U2_3.2), Quad-Stage-Prototype_FPGA_V1.0 (X5.43)
FPGA_B45: Row-Driver2 (R12_2.2 U1_2.2 U2_2.3), Quad-Stage-Prototype_FPGA_V1.0 (X5.45)
FPGA_B46: Row-Driver2 (R11_2.2 U1_2.3 U2_2.2), Quad-Stage-Prototype_FPGA_V1.0 (X5.46)
FPGA_B48: Row-Driver1 (R12_1.2 U1_1.2 U2_1.3), Quad-Stage-Prototype_FPGA_V1.0 (X5.48)
FPGA_B49: Row-Driver1 (R11_1.2 U1_1.3 U2_1.2), Quad-Stage-Prototype_FPGA_V1.0 (X5.49)
FPGA_C3: Quad-Stage-Prototype_V1.0 (X2.6), Quad-Stage-Prototype_FPGA_V1.0 (X6.3)
FPGA_C5: Quad-Stage-Prototype_V1.0 (X2.5), Quad-Stage-Prototype_FPGA_V1.0 (X6.5)
FPGA_C9: Quad-Stage-Prototype_V1.0 (X2.3), Quad-Stage-Prototype_FPGA_V1.0 (X6.9)
HV_EN: Quad-Stage-Prototype_V1.0 (X2.9), Quad-Stage-Prototype_Supply_V1.0 (R16.2 S2.2 TP3.1)
LED: Quad-Stage-Prototype_V1.0 (X2.8), Quad-Stage-Prototype_LED_V1.0 (R20.2 U5.2)